# Altium schematic sheet PSU.SchDoc
size A
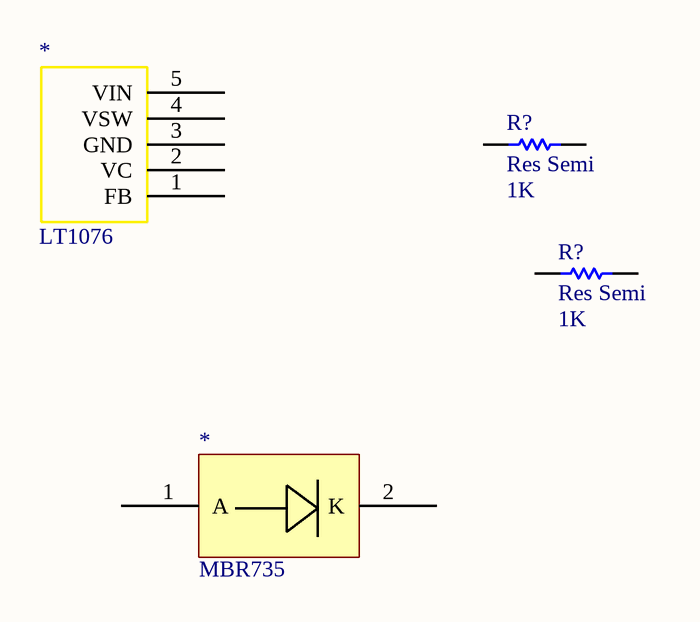
[diagram p0: PSU.SchDoc]

## Parts
(Parts that share a designator on the sheet are numbered #1, #2 ... from top to bottom, then left to right.)
*#1  LT1076  [LT1076]
*#2  MBR735  [MBR735]
R?#1  Res Semi  value 1K  [AXIAL-0.5]
R?#2  Res Semi  value 1K  [AXIAL-0.5]

## Nets

Not connected (* = marked no-connect by the designer): *#1 1(FB) 2(VC) 3(GND) 4(VSW) 5(VIN); *#2 1(A) 2(K); R?#1 1 2; R?#2 1 2

## Library data of the parts
R?#1 R?#2 = Res Semi: Semiconductor Resistor; Published: 8-Jun-2000; LatestRevisionDate: 17-Jul-2002; LatestRevisionNote: Re-released for DXP Platform.; PackageReference: AXIAL-0.5; Publisher: Altium Limited; PackageDescription: Axial Device, Thru-Hole; 2 Leads; 0.5 in Pin Spacing